# Altium schematic sheet MCU.SchDoc
size A4; SheetNumber: 4; SheetTotal: 6
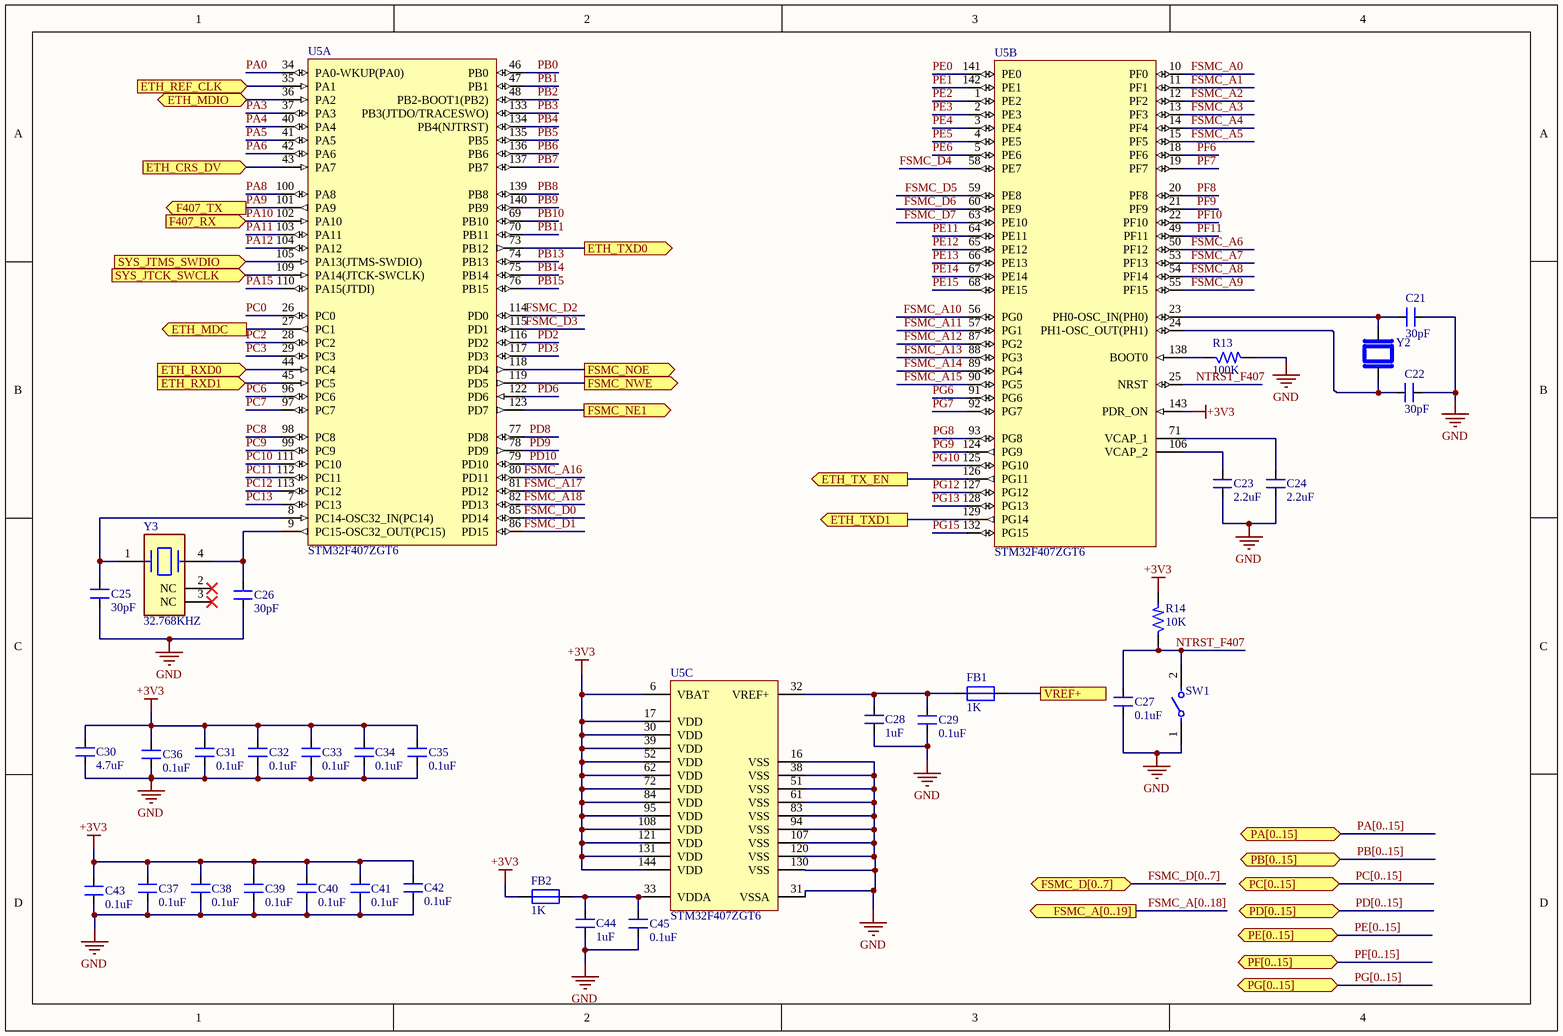
[diagram p0: MCU.SchDoc]

## Parts
C21  30pF  [CAP_0805]
C22  30pF  [CAP_0805]
C23  2.2uF  [CAP_0805]
C24  2.2uF  [CAP_0805]
C25  30pF  [CAP_0805]
C26  30pF  [CAP_0805]
C27  0.1uF  [CAP_0805]
C28  1uF  [CAP_0805]
C29  0.1uF  [CAP_0805]
C30  4.7uF  [CAP_0805]
C31  0.1uF  [CAP_0805]
C32  0.1uF  [CAP_0805]
C33  0.1uF  [CAP_0805]
C34  0.1uF  [CAP_0805]
C35  0.1uF  [CAP_0805]
C36  0.1uF  [CAP_0805]
C37  0.1uF  [CAP_0805]
C38  0.1uF  [CAP_0805]
C39  0.1uF  [CAP_0805]
C40  0.1uF  [CAP_0805]
C41  0.1uF  [CAP_0805]
C42  0.1uF  [CAP_0805]
C43  0.1uF  [CAP_0805]
C44  1uF  [CAP_0805]
C45  0.1uF  [CAP_0805]
FB1  1K  [IND_0805]
FB2  1K  [IND_0805]
R13  100K  [RES_0805]
R14  10K  [RES_0603]
SW1  147873-1  [FP-147873-1-MFG]  (value not drawn)
U5  STM32F407ZGT6  [STM-LQFP144_L]  (parts A,B,C of 3)
Y2  ATS08A-E  [XTAL_HC49P488W43L1085T450H368]  (value not drawn)
Y3  32.768KHZ  [FP-ABS25-MFG]

## Ports
ETH_CRS_DV (in, see ETH[1B]), ETH_MDC (out, see ETH[1B]), ETH_MDIO (bidir, see ETH[1B]), ETH_REF_CLK (in, see ETH[2A]), ETH_RXD0 (in, see ETH[1C]), ETH_RXD1 (in, see ETH[1C]), ETH_TX_EN (out, see ETH[1B]), ETH_TXD0 (out, see ETH[1B]), ETH_TXD1 (out, see ETH[1B]), F407_RX (in, see ST-link V2[1D]), F407_TX (out, see ST-link V2[1D]), FSMC_A[0..19] (out, see Memory+GPIO[1A]), FSMC_D[0..7] (bidir, see Memory+GPIO[1A]), FSMC_NE1 (out, see Memory+GPIO[2D]), FSMC_NOE (out, see Memory+GPIO[2D]), FSMC_NWE (out, see Memory+GPIO[2D]), PA[0..15] (bidir, see Memory+GPIO[1A]), PB[0..15] (bidir, see Memory+GPIO[1A]), PC[0..15] (bidir, see Memory+GPIO[1A]), PD[0..15] (bidir, see Memory+GPIO[1B]), PE[0..15] (bidir, see Memory+GPIO[1B]), PF[0..15] (bidir, see Memory+GPIO[1B]), PG[0..15] (bidir, see Memory+GPIO[1B]), SYS_JTCK_SWCLK (in, see ST-link V2[3B]), SYS_JTMS_SWDIO (in, see ST-link V2[3B]), VREF+ (see Memory+GPIO[1A])

## Nets
+3V3: C30.2 C31.2 C32.2 C33.2 C34.2 C35.2 C36.2 C37.2 C38.2 C39.2 C40.2 C41.2 C42.2 C43.2 FB2.1 R14.2 U5.6(VBAT) U5.17(VDD) U5.30(VDD) U5.39(VDD) U5.52(VDD) U5.62(VDD) U5.72(VDD) U5.84(VDD) U5.95(VDD) U5.108(VDD) U5.121(VDD) U5.131(VDD) U5.143(PDR_ON) U5.144(VDD)
GND: C21.2 C22.2 C23.1 C24.1 C25.1 C26.1 C27.1 C28.1 C29.1 C30.1 C31.1 C32.1 C33.1 C34.1 C35.1 C36.1 C37.1 C38.1 C39.1 C40.1 C41.1 C42.1 C43.1 C44.1 C45.1 R13.2 SW1.1 U5.16(VSS) U5.31(VSSA) U5.38(VSS) U5.51(VSS) U5.61(VSS) U5.83(VSS) U5.94(VSS) U5.107(VSS) U5.120(VSS) U5.130(VSS)
ETH_CRS_DV: U5.43(PA7) ; port ETH_CRS_DV
ETH_MDC: U5.27(PC1) ; port ETH_MDC
ETH_MDIO: U5.36(PA2) ; port ETH_MDIO
ETH_REF_CLK: U5.35(PA1) ; port ETH_REF_CLK
ETH_RXD0: U5.44(PC4) ; port ETH_RXD0
ETH_RXD1: U5.45(PC5) ; port ETH_RXD1
ETH_TX_EN: U5.126(PG11) ; port ETH_TX_EN
ETH_TXD0: U5.73(PB12) ; port ETH_TXD0
ETH_TXD1: U5.129(PG14) ; port ETH_TXD1
FSMC_A0: U5.10(PF0)
FSMC_A1: U5.11(PF1)
FSMC_A2: U5.12(PF2)
FSMC_A3: U5.13(PF3)
FSMC_A4: U5.14(PF4)
FSMC_A5: U5.15(PF5)
FSMC_A6: U5.50(PF12)
FSMC_A7: U5.53(PF13)
FSMC_A8: U5.54(PF14)
FSMC_A9: U5.55(PF15)
FSMC_A10: U5.56(PG0)
FSMC_A11: U5.57(PG1)
FSMC_A12: U5.87(PG2)
FSMC_A13: U5.88(PG3)
FSMC_A14: U5.89(PG4)
FSMC_A15: U5.90(PG5)
FSMC_A16: U5.80(PD11)
FSMC_A17: U5.81(PD12)
FSMC_A18: U5.82(PD13)
FSMC_D0: U5.85(PD14)
FSMC_D1: U5.86(PD15)
FSMC_D2: U5.114(PD0)
FSMC_D3: U5.115(PD1)
FSMC_D4: U5.58(PE7)
FSMC_D5: U5.59(PE8)
FSMC_D6: U5.60(PE9)
FSMC_D7: U5.63(PE10)
FSMC_NE1: U5.123(PD7) ; port FSMC_NE1
FSMC_NOE: U5.118(PD4) ; port FSMC_NOE
FSMC_NWE: U5.119(PD5) ; port FSMC_NWE
NTRST_F407: C27.2 R14.1 SW1.2 U5.25(NRST)
PA0: U5.34(PA0-WKUP(PA0))
PA3: U5.37(PA3)
PA4: U5.40(PA4)
PA5: U5.41(PA5)
PA6: U5.42(PA6)
PA8: U5.100(PA8)
PA9: U5.101(PA9) ; port F407_TX
PA10: U5.102(PA10) ; port F407_RX
PA11: U5.103(PA11)
PA12: U5.104(PA12)
PA15: U5.110(PA15(JTDI))
PB0: U5.46(PB0)
PB1: U5.47(PB1)
PB2: U5.48(PB2-BOOT1(PB2))
PB3: U5.133(PB3(JTDO/TRACESWO))
PB4: U5.134(PB4(NJTRST))
PB5: U5.135(PB5)
PB6: U5.136(PB6)
PB7: U5.137(PB7)
PB8: U5.139(PB8)
PB9: U5.140(PB9)
PB10: U5.69(PB10)
PB11: U5.70(PB11)
PB13: U5.74(PB13)
PB14: U5.75(PB14)
PB15: U5.76(PB15)
PC0: U5.26(PC0)
PC2: U5.28(PC2)
PC3: U5.29(PC3)
PC6: U5.96(PC6)
PC7: U5.97(PC7)
PC8: U5.98(PC8)
PC9: U5.99(PC9)
PC10: U5.111(PC10)
PC11: U5.112(PC11)
PC12: U5.113(PC12)
PC13: U5.7(PC13)
PD2: U5.116(PD2)
PD3: U5.117(PD3)
PD6: U5.122(PD6)
PD8: U5.77(PD8)
PD9: U5.78(PD9)
PD10: U5.79(PD10)
PE0: U5.141(PE0)
PE1: U5.142(PE1)
PE2: U5.1(PE2)
PE3: U5.2(PE3)
PE4: U5.3(PE4)
PE5: U5.4(PE5)
PE6: U5.5(PE6)
PE11: U5.64(PE11)
PE12: U5.65(PE12)
PE13: U5.66(PE13)
PE14: U5.67(PE14)
PE15: U5.68(PE15)
PF6: U5.18(PF6)
PF7: U5.19(PF7)
PF8: U5.20(PF8)
PF9: U5.21(PF9)
PF10: U5.22(PF10)
PF11: U5.49(PF11)
PG6: U5.91(PG6)
PG7: U5.92(PG7)
PG8: U5.93(PG8)
PG9: U5.124(PG9)
PG10: U5.125(PG10)
PG12: U5.127(PG12)
PG13: U5.128(PG13)
PG15: U5.132(PG15)
SYS_JTCK_SWCLK: U5.109(PA14(JTCK-SWCLK)) ; port SYS_JTCK_SWCLK
SYS_JTMS_SWDIO: U5.105(PA13(JTMS-SWDIO)) ; port SYS_JTMS_SWDIO
VREF+: FB1.2 ; port VREF+
NetC21_1: C21.1 U5.23(PH0-OSC_IN(PH0)) Y2.2
NetC22_1: C22.1 U5.24(PH1-OSC_OUT(PH1)) Y2.1
NetC23_2: C23.2 U5.106(VCAP_2)
NetC24_2: C24.2 U5.71(VCAP_1)
NetC25_2: C25.2 U5.8(PC14-OSC32_IN(PC14)) Y3.1
NetC26_2: C26.2 U5.9(PC15-OSC32_OUT(PC15)) Y3.4
NetC28_2: C28.2 C29.2 FB1.1 U5.32(VREF+)
NetC44_2: C44.2 C45.2 FB2.2 U5.33(VDDA)
NetR13_1: R13.1 U5.138(BOOT0)

Not connected (* = marked no-connect by the designer): Y3 2(NC)* 3(NC)*

## Buses and harness runs
bus FSMC_A[0..18] = port FSMC_A[0..19]
bus FSMC_D[0..7] = port FSMC_D[0..7]
bus PA[0..15] = port PA[0..15]
bus PB[0..15] = port PB[0..15]
bus PC[0..15] = port PC[0..15]
bus PD[0..15] = port PD[0..15]
bus PE[0..15] = port PE[0..15]
bus PF[0..15] = port PF[0..15]
bus PG[0..15] = port PG[0..15]

## Library data of the parts
C21 C22 C25 C26 = CAP_30pF-50V-10%-0805: ±10% 50V Ceramic Capacitor C0G, NP0 0805 (2012 Metric); Manufacturer Part Number: C0805C300K5GAC7800; Manufacturer: KEMET; Alternate Part Number: NA; Case/Package: 0805; Supplier-1: Digikey; Supplier Part Number-1: 399-17443-1-ND - Cut Tape (CT)
C23 C24 = CAP_2.2uF-25V-10%-0805: 2.2µF ±10% 25V Ceramic Capacitor X7R 0805 (2012 Metric); Manufacturer: KEMET; Manufacturer Part Number: CL21B225KAFNFNE; Alternate Part Number-1: NA; Case/Package: 0805; Supplier-1: SIRICOM; Supplier Part Number-1: CL21A225KAFNNNE
C27 C29 C31-C43 C45 = CAP_0.1uF-50V-10%-0805: 0.1µF ±10% 50V Ceramic Capacitor X7R 0805 (2012 Metric); Manufacturer: Samsung; Manufacturer Part Number: CL21B104KBCNNNC; Alternate Part Number-1: NA; Case/Package: 0805; Supplier-1: SIRICOM; Supplier Part Number-1: 0805B104K500CT
C28 C44 = CAP_1uF-50V-5%-0805: 1µF ±5% 50V Ceramic Capacitor X7R 0805 (2012 Metric); Manufacturer: Samsung; Manufacturer Part Number: CC0805JKX7R9BB105; Alternate Part Number-1: 0805F105M500NT; Case/Package: 0805; Supplier-1: SIRICOM; Supplier Part Number-1: CL21B105KBFNNNE
C30 = CAP_4.7uF-50V-10%-0805: 4.7µF ±10% 50V Ceramic Capacitor X5R 0805 (2012 Metric); Manufacturer: Yageo; Manufacturer Part Number: GRM21BR61H475KE51L; Alternate Part Number-1: NA; Case/Package: 0805; Supplier-1: SIRICOM; Supplier Part Number-1: CL21A475KBQNNNE
FB1 FB2 = FB_1K-100MHZ-1.6A-0805: 1 kOhms @ 100MHz 1 Power Line Ferrite Bead 0805 (2012 Metric) 1.6A; Manufacturer: Laird; Manufacturer Part Number: BLM21SP102SH1D; Alternate Part Number-1: NA; Case/Package: 0805; Supplier-1: SIRICOM; Supplier Part Number-1: ACMS201209A102
R13 = RES_100K-0.125W-1%-0805: 100 kOhms ±1% 0.125W, 1/8W Chip Resistor 0805 (2012 Metric) Automotive AEC-Q200 Thick Film; Manufacturer: Walsin; Manufacturer Part Number: WR08X1003FTL; Alternate Part Number-1: NA; Case/Package: 0805; Supplier-1: SIRICOM; Supplier Part Number-1: WR08X1003FTL
R14 = RES_10K-0.1W-1%-0603: 10 kOhms ±1% 0.1W, 1/10W Chip Resistor 0603 (1608 Metric) Automotive AEC-Q200 Thick Film; Manufacturer: Walsin; Manufacturer Part Number: WR06X1002FTL; Alternate Part Number-1: 0603WAJ0103T5E; Case/Package: 0603; Supplier-1: SIRICOM; Supplier Part Number-1: WR06X1002FTL
SW1 = CMP-03407-000005-1: SWITCH TACTILE SPST-NO 0.05A 24V; Manufacturer: TE Connectivity; Contact Resistance: 100mΩ; Operating Force: 180gf; Electromechanical Life: 40000Cycles; Contact Current Rating: 50mA; Throw Configuration: SPST-NO; Mouser Description: Switch Tactile OFF (ON) SPST Rectangular Button J-Bend 0.05A 24VDC 1.77N SMD T/R; Mount: Surface Mount; Height: 5.5mm; Category: Switch; RoHS: TRUE; Temperature Range High: +85°C; ComponentLink2Description: Datasheet; Temperature Range Low: -35°C; Device Class L1: Electromechanical; Device Class L2: Switches; Package: 0; Temperature: -35°C to +85°C; Device Class L3: Tactile Switches; Automotive: No; Manufacturer Part Number: 147873-1; ComponentLink2URL: https://www.te.com/commerce/DocumentDelivery/DDEController?Action=showdoc&DocId=Customer+Drawing%7F147873%7FK3%7Fpdf%7FEnglish%7FENG_CD_147873_K3.pdf%7F147873-1; Lead Free: Yes; Voltage Rating Dc: 24V; Octopart: https://octopart.com/147873-1-te+connectivity-40818451; Digikey Description: SWITCH TACTILE SPST-NO 0.05A 24V
U5 = CMP-0243-00025-3: ARM Cortex-M4 32-bit MCU+FPU, 210 DMIPS, 1024 kB Flash, 192 kB Internal RAM, 114 I/Os, 144-pin LQFP, -40 to 85 degC, Tray; Manufacturer: STMicroelectronics; I/Os (High Current): 114; FLASH Size (Prog) (kB): 1024; Supply Voltage(Vcc) max (V): 3.6; Internal RAM Size (kB): 192; Operating Frequency(F) (Processor speed) (MHz): 168; Supply Voltage(Vcc) min (V): 1.8; D/A Converter: 2x12-bit; PartNumber: STM32F407ZGT6; PackageDescription: 144-Pin Low Profile Quad Flat Package, 20 x 20 mm Body, 0.5 mm Pitch; Mounting Technology: Surface Mount; ComponentLink3Description: Package Specification; ComponentLink3URL: http://www.st.com/st-web-ui/static/active/en/resource/technical/document/datasheet/DM00037051.pdf; ComponentLink1URL: http://www.st.com/web/en/home.html; ComponentLink2URL: http://www.st.com/st-web-ui/static/active/en/resource/technical/document/datasheet/DM00037051.pdf; Core: ARM Cortex-M4; ComponentLink1Description: Manufacturer URL; PackageVersion: Rev. 4, 06/2013; ComponentLink2Description: Datasheet; PackageReference: LQFP144; Packing: Tray; DatasheetVersion: Rev. 4
Y2 = ATS08A-E: 8 MHz Â±30ppm Crystal 20pF 60 Ohms HC-49/US; MF: CTS; SnapEDA_Link: https://www.snapeda.com/parts/ATS08A-E/CTS+Components/view-part/?ref=snap; Package: HC-49/US CTS-Frequency Controls; Value: *; MP: ATS08A-E; Check_prices: https://www.snapeda.com/parts/ATS08A-E/CTS+Components/view-part/?ref=eda
Y3 = CMP-2000-05037-2: CRYSTAL 32.7680KHZ 12.5PF SMD; ESR (Equivalent Series Resistance): 50kR; Tolerance: 20ppm; Width: 3.8mm; REACH SVHC: No SVHC; Load Capacitance: 12.5pF; Case/Package: SMD/SMT; Radiation Hardening: No; Series: ABS25; Number of Pins: 4; Mount: Surface Mount; RoHS Compliant: Yes; Packaging: Tape and Reel; Termination: SMD/SMT; Frequency Tolerance: 20ppm; Lead Free: Lead Free; Package Quantity: 1000; Min Operating Temperature: -40°C; Height: 0.098inch; Length: 8mm; Frequency: 32.768kHz; Max Operating Temperature: 85°C; Series Resistance: 50kR; Operating Frequency: 32.768 kHz; Depth: 3.8mm